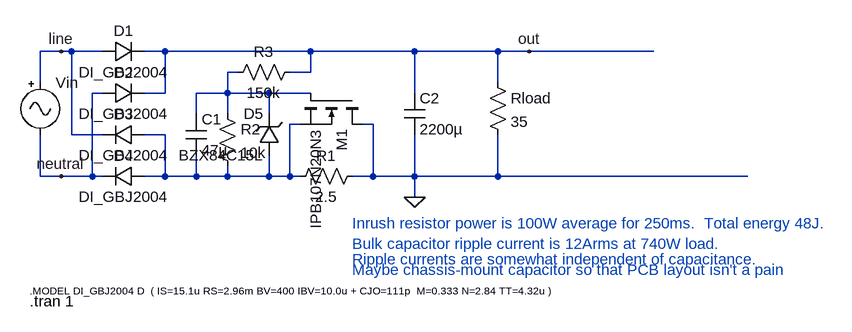
[diagram p0: schematic powerSupply.asc]
powerSupply.asc, the LTspice schematic file:
Version 4
SHEET 1 1144 680
WIRE -32 64 -64 64
WIRE -16 64 -32 64
WIRE 32 64 -16 64
WIRE 128 64 96 64
WIRE 352 64 128 64
WIRE 512 64 352 64
WIRE 640 64 512 64
WIRE 688 64 640 64
WIRE 880 64 688 64
WIRE 240 96 224 96
WIRE 352 96 352 64
WIRE 352 96 320 96
WIRE -64 112 -64 64
WIRE 640 112 640 64
WIRE 32 128 16 128
WIRE 128 128 128 64
WIRE 128 128 96 128
WIRE 224 128 224 96
WIRE 224 128 176 128
WIRE 288 128 224 128
WIRE 352 128 288 128
WIRE 512 128 512 64
WIRE 176 160 176 128
WIRE 224 160 224 128
WIRE 288 160 288 128
WIRE 336 176 320 176
WIRE 448 176 432 176
WIRE -16 192 -16 64
WIRE 32 192 -16 192
WIRE 128 192 96 192
WIRE -64 256 -64 192
WIRE -32 256 -64 256
WIRE 16 256 16 128
WIRE 16 256 -32 256
WIRE 32 256 16 256
WIRE 128 256 128 192
WIRE 128 256 96 256
WIRE 176 256 176 224
WIRE 176 256 128 256
WIRE 224 256 224 240
WIRE 224 256 176 256
WIRE 288 256 288 224
WIRE 288 256 224 256
WIRE 320 256 320 176
WIRE 320 256 288 256
WIRE 336 256 320 256
WIRE 448 256 448 176
WIRE 448 256 416 256
WIRE 512 256 512 192
WIRE 512 256 448 256
WIRE 640 256 640 192
WIRE 640 256 512 256
WIRE 1024 256 640 256
WIRE 512 288 512 256
FLAG 512 288 0
FLAG 688 64 out
FLAG -32 64 line
FLAG -32 256 neutral
SYMBOL Misc\\signal -64 96 R0
WINDOW 3 24 104 Invisible 2
WINDOW 123 0 0 Left 0
WINDOW 39 0 0 Left 0
SYMATTR Value SINE(0 170 60)
SYMATTR InstName Vin
SYMBOL diode 32 80 R270
WINDOW 0 32 32 VTop 2
WINDOW 3 0 32 VBottom 2
SYMATTR InstName D1
SYMATTR Value DI_GBJ2004
SYMBOL diode 32 144 R270
WINDOW 0 32 32 VTop 2
WINDOW 3 0 32 VBottom 2
SYMATTR InstName D2
SYMATTR Value DI_GBJ2004
SYMBOL diode 96 176 R90
WINDOW 0 0 32 VBottom 2
WINDOW 3 32 32 VTop 2
SYMATTR InstName D3
SYMATTR Value DI_GBJ2004
SYMBOL diode 96 240 R90
WINDOW 0 0 32 VBottom 2
WINDOW 3 32 32 VTop 2
SYMATTR InstName D4
SYMATTR Value DI_GBJ2004
SYMBOL nmos 432 128 R90
SYMATTR InstName M1
SYMATTR Value IPB107N20N3
SYMBOL res 432 240 R90
WINDOW 0 0 56 VBottom 2
WINDOW 3 32 56 VTop 2
SYMATTR InstName R1
SYMATTR Value 2.5
SYMBOL res 208 144 R0
SYMATTR InstName R2
SYMATTR Value 10k
SYMBOL cap 160 160 R0
SYMATTR InstName C1
SYMATTR Value 47µ
SYMBOL zener 304 224 R180
WINDOW 0 24 64 Left 2
WINDOW 3 24 0 Left 2
SYMATTR InstName D5
SYMATTR Value BZX84C15L
SYMBOL res 336 80 R90
WINDOW 0 0 56 VBottom 2
WINDOW 3 32 56 VTop 2
SYMATTR InstName R3
SYMATTR Value 150k
SYMBOL cap 496 128 R0
SYMATTR InstName C2
SYMATTR Value 2200µ
SYMATTR SpiceLine Irms=10 Rser=10m
SYMBOL res 624 96 R0
SYMATTR InstName Rload
SYMATTR Value 35
TEXT -80 432 Left 1 !.MODEL DI_GBJ2004 D  ( IS=15.1u RS=2.96m BV=400 IBV=10.0u + CJO=111p  M=0.333 N=2.84 TT=4.32u )
TEXT -80 448 Left 2 !.tran 1
TEXT 416 384 Left 2 ;Ripple currents are somewhat independent of capacitance.
TEXT 416 400 Left 2 ;Maybe chassis-mount capacitor so that PCB layout isn't a pain
TEXT 416 328 Left 2 ;Inrush resistor power is 100W average for 250ms.  Total energy 48J.
TEXT 416 360 Left 2 ;Bulk capacitor ripple current is 12Arms at 740W load.

The netlist it stands for:
* powerSupply.asc
Vin line neutral SINE(0 170 60)
D1 line out DI_GBJ2004
D2 neutral out DI_GBJ2004
D3 N002 line DI_GBJ2004
D4 N002 neutral DI_GBJ2004
M1 0 N001 N002 N002 IPB107N20N3
R1 0 N002 2.5
R2 N001 N002 10k
C1 N001 N002 47µ
D5 N002 N001 BZX84C15L
R3 out N001 150k
C2 out 0 2200µ Irms=10 Rser=10m
Rload out 0 35
.model D D
.lib standard.dio
.model NMOS NMOS
.model PMOS PMOS
.lib standard.mos
.MODEL DI_GBJ2004 D  ( IS=15.1u RS=2.96m BV=400 IBV=10.0u + CJO=111p  M=0.333 N=2.84 TT=4.32u )
.tran 1
* Ripple currents are somewhat independent of capacitance.
* Maybe chassis-mount capacitor so that PCB layout isn't a pain
* Inrush resistor power is 100W average for 250ms.  Total energy 48J.
* Bulk capacitor ripple current is 12Arms at 740W load.
.backanno
.end